# EAGLE schematic BBS_female (EAGLE 9.6.2)
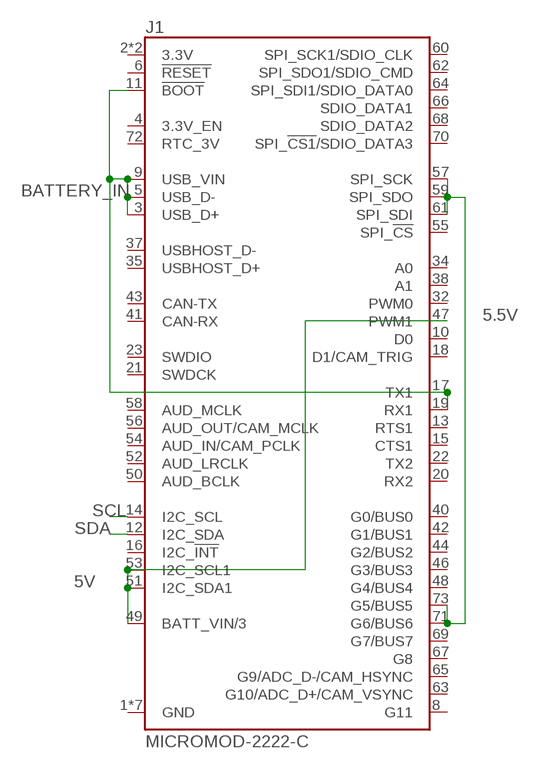
[diagram p0: schematic, sheet 1]

## Parts
J1  MICROMOD-2222-C  [M.2-CONNECTOR-E]

## Nets
5.5V: J1.57(SPI_SCK) J1.59(SPI_SDO) J1.61(SPI_SDI) J1.71(G6/BUS6) J1.73(G5/BUS5)
5V: J1.47(PWM1) J1.49(BATT_VIN/3) J1.51(I2C_SDA1) J1.53(I2C_SCL1)
BATTERY_IN: J1.3(USB_D+) J1.5(USB_D-) J1.9(USB_VIN) J1.11(!BOOT!) J1.17(TX1) J1.19(RX1)
SCL: J1.14(I2C_SCL)
SDA: J1.12(I2C_SDA)
Unconnected: J1.1(GND) J1.2(3.3V) J1.4(3.3V_EN) J1.6(!RESET!) J1.7(GND) J1.8(G11) J1.10(D0) J1.13(RTS1) J1.15(CTS1) J1.16(I2C_!INT!) J1.18(D1/CAM_TRIG) J1.20(RX2) J1.21(SWDCK) J1.22(TX2) J1.23(SWDIO) J1.32(PWM0) J1.33(GND) J1.34(A0) J1.35(USBHOST_D+) J1.36(GND) J1.37(USBHOST_D-) J1.38(A1) J1.39(GND) J1.40(G0/BUS0) J1.41(CAN-RX) J1.42(G1/BUS1) J1.43(CAN-TX) J1.44(G2/BUS2) J1.45(GND) J1.46(G3/BUS3) J1.48(G4/BUS4) J1.50(AUD_BCLK) J1.52(AUD_LRCLK) J1.54(AUD_IN/CAM_PCLK) J1.55(SPI_!CS!) J1.56(AUD_OUT/CAM_MCLK) J1.58(AUD_MCLK) J1.60(SPI_SCK1/SDIO_CLK) J1.62(SPI_SDO1/SDIO_CMD) J1.63(G10/ADC_D+/CAM_VSYNC) J1.64(SPI_SDI1/SDIO_DATA0) J1.65(G9/ADC_D-/CAM_HSYNC) J1.66(SDIO_DATA1) J1.67(G8) J1.68(SDIO_DATA2) J1.69(G7/BUS7) J1.70(SPI_!CS1!/SDIO_DATA3) J1.72(RTC_3V) J1.74(3.3V) J1.75(GND)

## Library data of the parts
J1 = SparkFun-MicroMod:MICROMOD: MicroMod Connector Description: A card edge connector and mating PCB connector to allow various MicroMod Processor Boards to be coupled with various carrier boards of different capabilities. Based on the M.2 standard.; PROD_ID: CONN-14877